# EAGLE design IOBR (EAGLE 9.5.1)
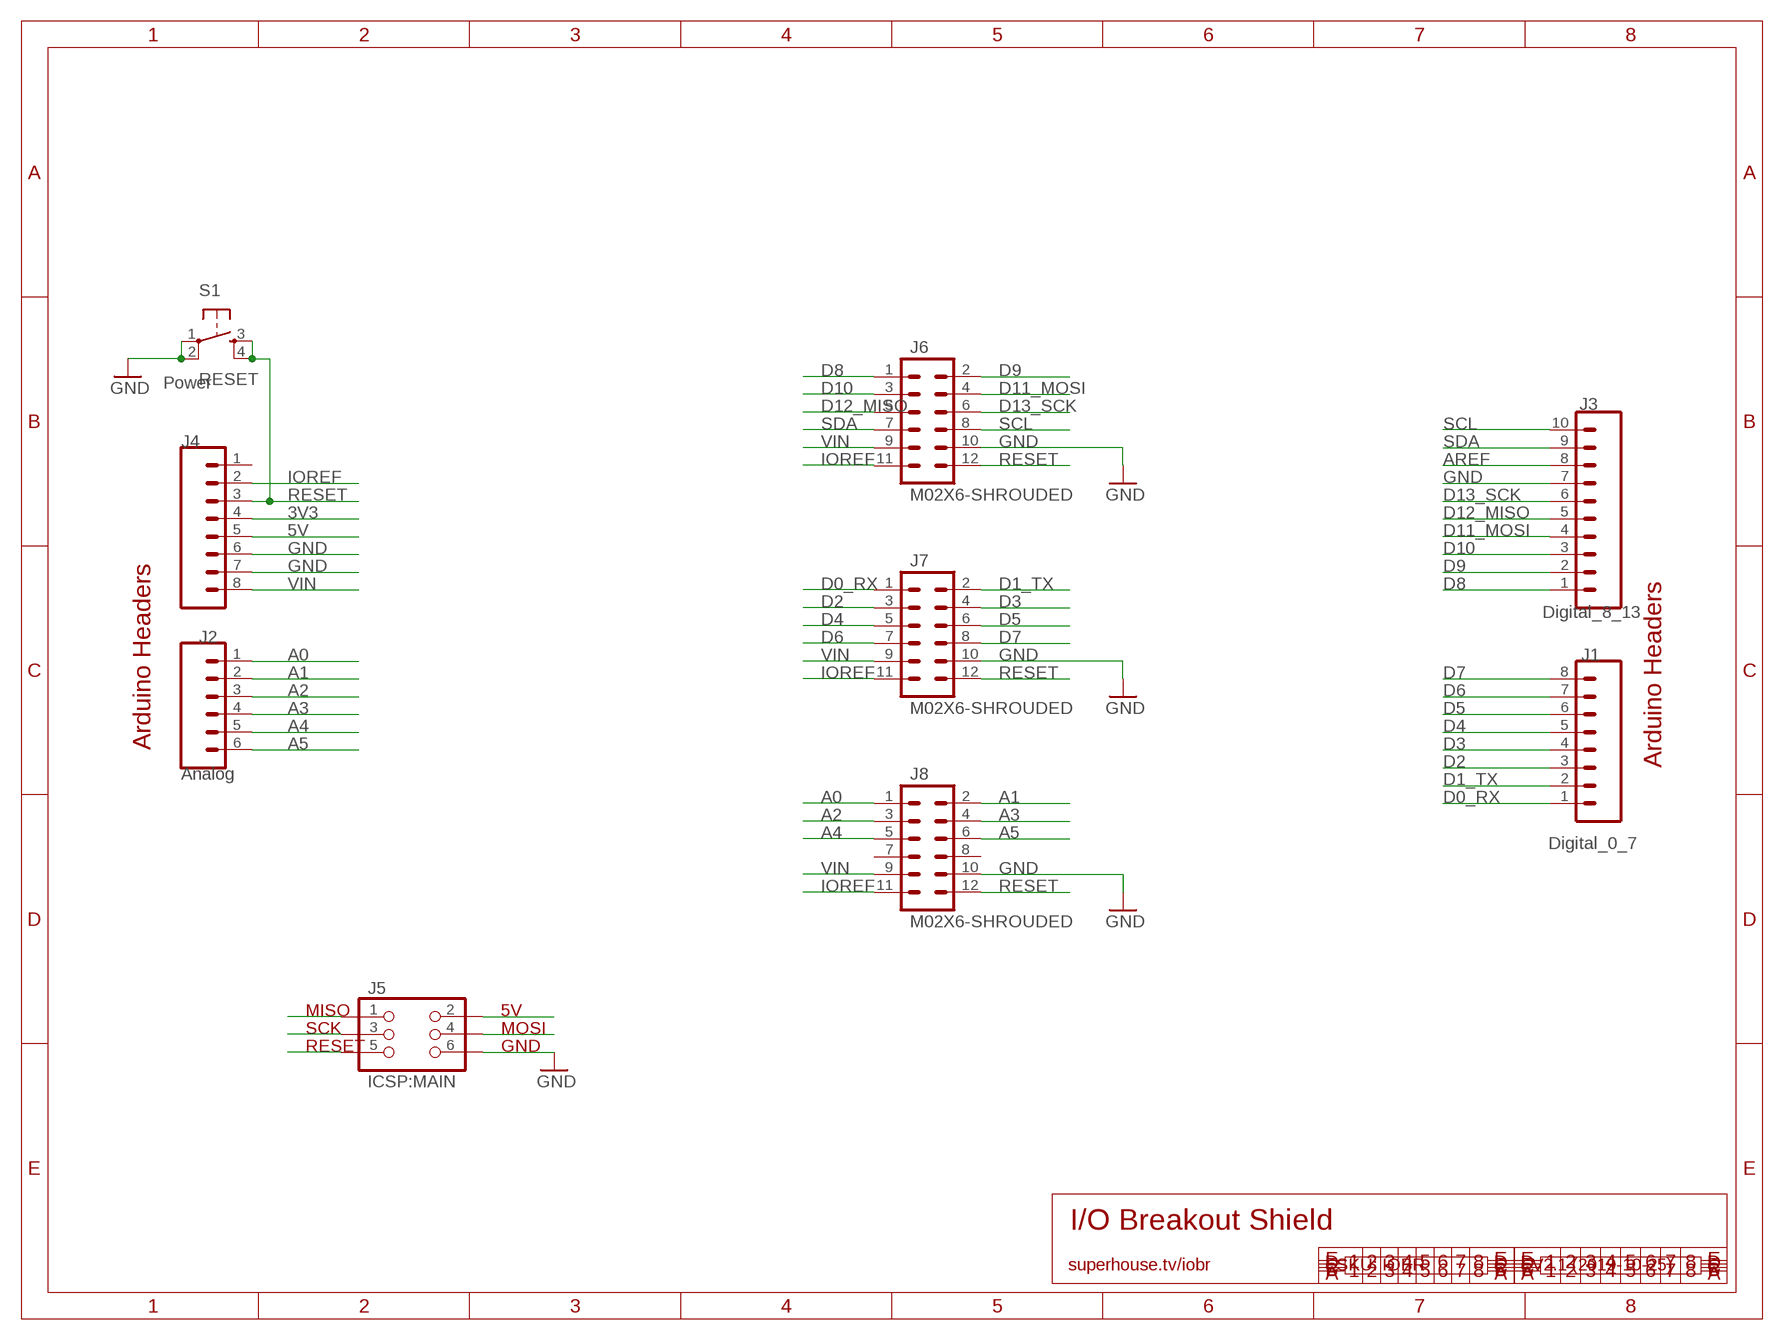
[diagram p0: schematic, sheet 1]

## Parts
J1  Digital_0_7  M08-PIN-BELOW  [1X08-P-BELOW]
J2  Analog  M06-PIN-BELOW  [1X06-P-BELOW]
J3  Digital_8_13  M10-PIN-BELOW  [1X10-P-BELOW]
J4  Power  M08-PIN-BELOW  [1X08-P-BELOW]
J5  ICSP:MAIN  ICSP-ST-BELOW  [2X03-ICSP-ST-BELOW]
J6  M02X6-SHROUDED  [2X06-SHROUDED]
J7  M02X6-SHROUDED  [2X06-SHROUDED]
J8  M02X6-SHROUDED  [2X06-SHROUDED]
S1  RESET  TAC_SWITCH-PTH-6  [TACTILE-PTH-6MM]

## Nets
3V3: J4.4
5V: J4.5
A0: J2.1 J8.1
A1: J2.2 J8.2
A2: J2.3 J8.3
A3: J2.4 J8.4
A4: J2.5 J8.5
A5: J2.6 J8.6
AREF: J3.8
D0_RX: J1.1 J7.1
D1_TX: J1.2 J7.2
D2: J1.3 J7.3
D3: J1.4 J7.4
D4: J1.5 J7.5
D5: J1.6 J7.6
D6: J1.7 J7.7
D7: J1.8 J7.8
D8: J3.1 J6.1
D9: J3.2 J6.2
D10: J3.3 J6.3
D11_MOSI: J3.4 J6.4
D12_MISO: J3.5 J6.5
D13_SCK: J3.6 J6.6
GND: J3.7 J4.6 J4.7 J5.6 J6.10 J7.10 J8.10 S1.1 S1.2
IOREF: J4.2 J6.11 J7.11 J8.11
N$186: J5.1
N$187: J5.3
N$188: J5.5
N$197: J5.2
N$198: J5.4
RESET: J4.3 J6.12 J7.12 J8.12 S1.3 S1.4
SCL: J3.10 J6.8
SDA: J3.9 J6.7
VIN: J4.8 J6.9 J7.9 J8.9
Unconnected: J4.1 J8.7 J8.8

## Notes on the sheet
- Arduino Headers
- Arduino Headers
- MISO | 5V
- SCK | MOSI
- RESET | GND
- I/O Breakout Shield
- superhouse.tv/iobr | SKU: IOBR | V2.1 (2019-10-25)

## Library data of the parts
J1 J4 = SuperHouse-Connectors:M08: 8-way header Standard 1x8 header, and screw terminal variations
J2 = SuperHouse-Connectors:M06: 6-way header Standard 1x6 header, and screw terminal variations
J3 = SuperHouse-Connectors:M10: 10-way header Standard 1x10 header, and screw terminal variations
J5 = SuperHouse-Connectors:ICSP
J6-J8 = SuperHouse-Connectors:M02X6: M12 header in 2x6 format
S1 = SuperHouse-Switches:TAC_SWITCH: Momentary Switch Tactile switch, normally-open.

## Board
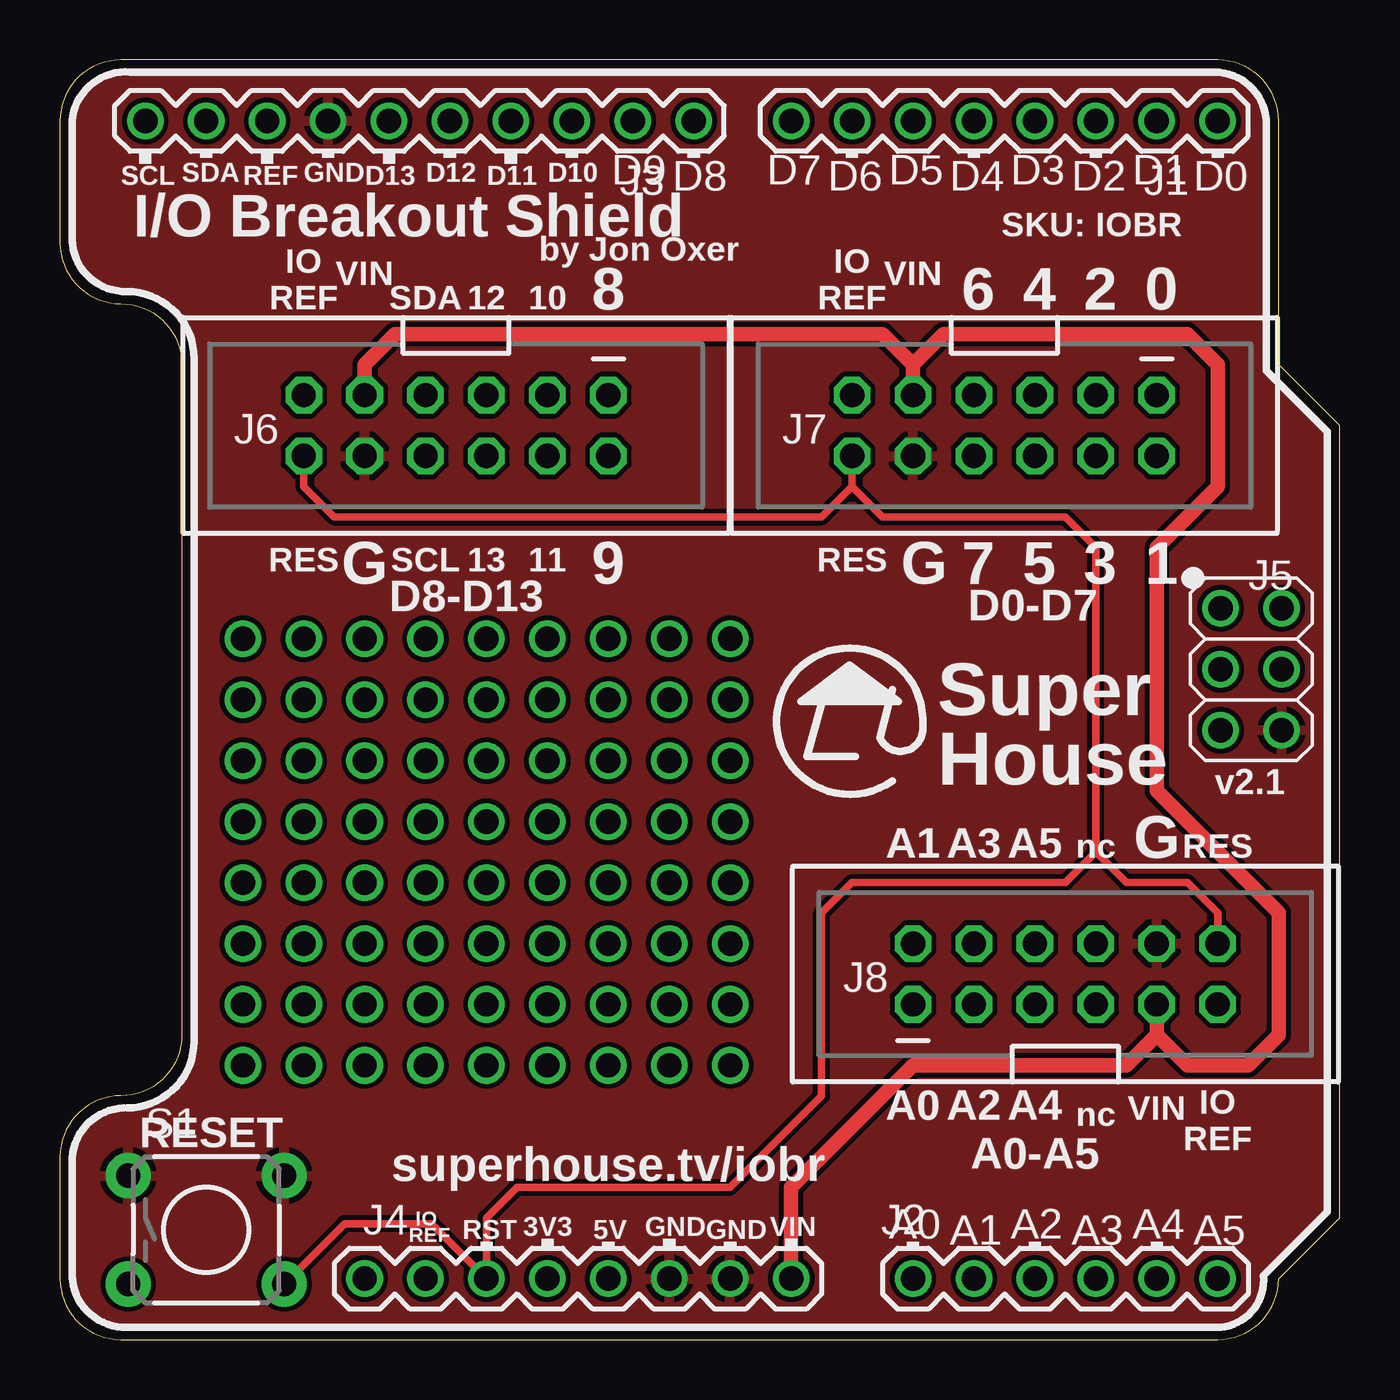
[diagram p1: board, top side]
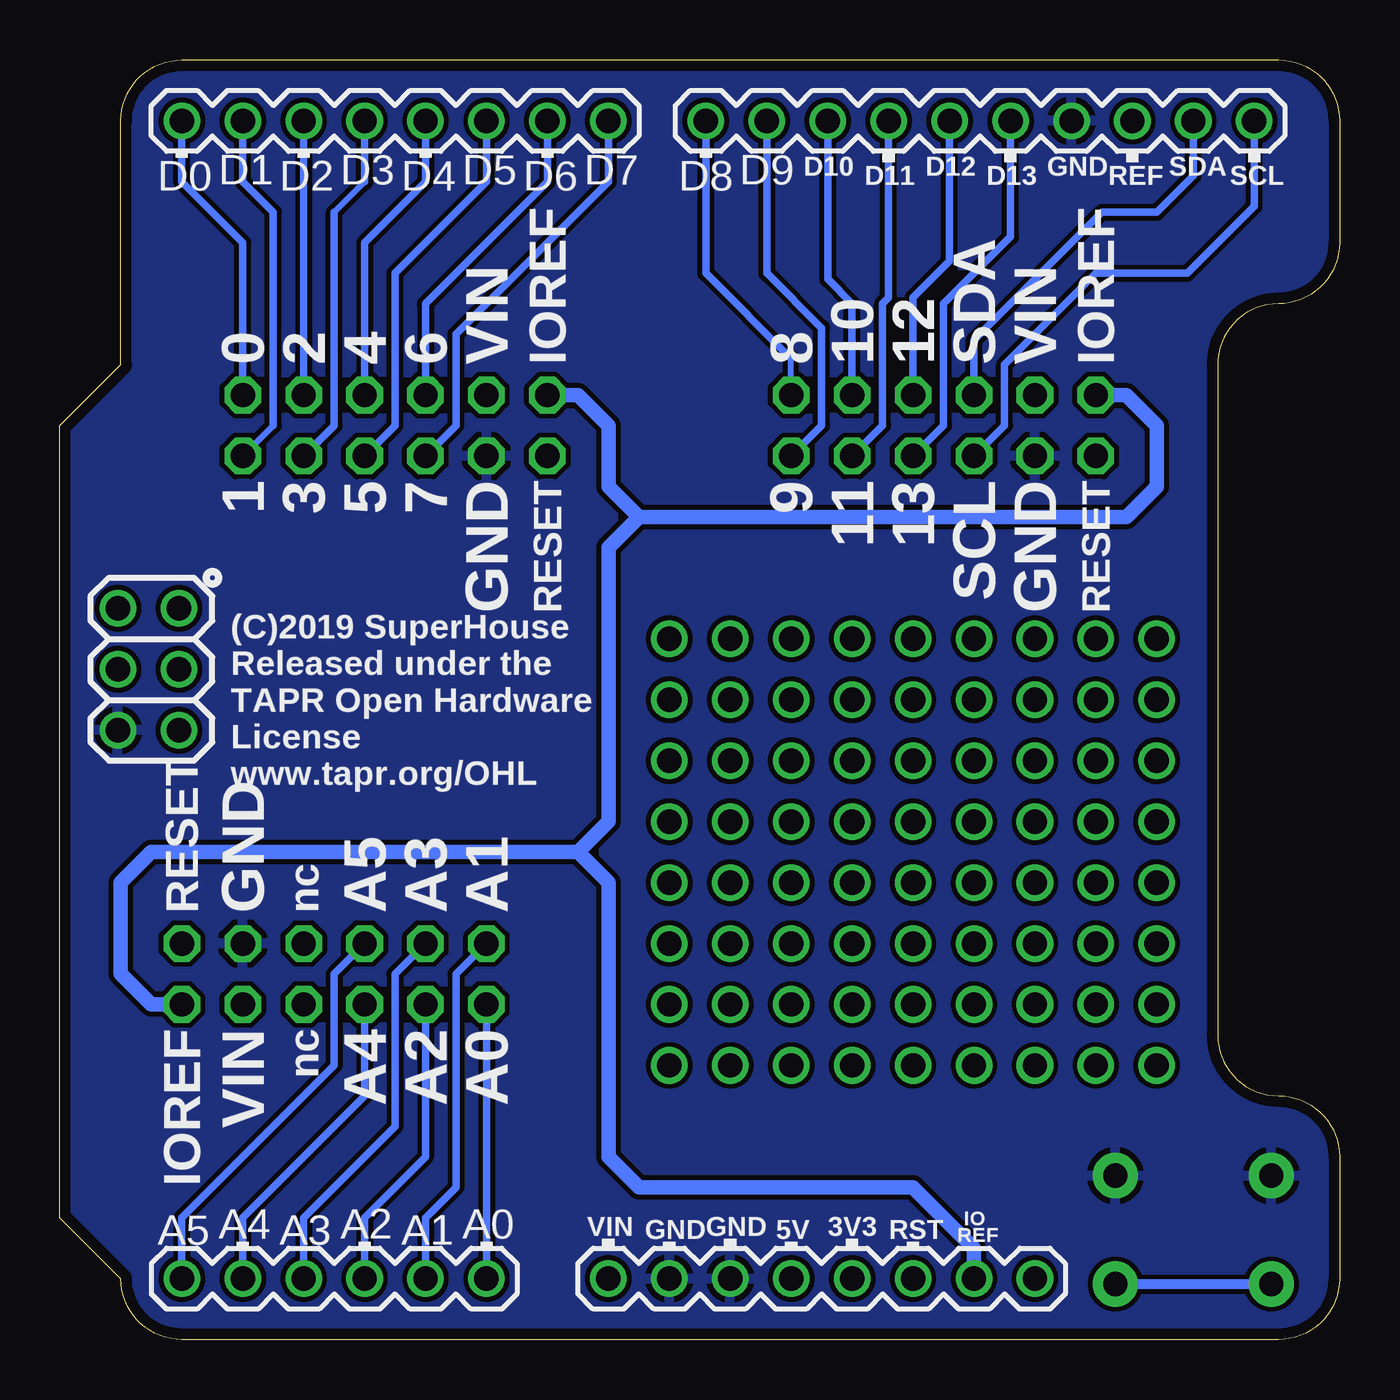
[diagram p2: board, bottom side, seen from below]

Size 53.34 x 53.34 mm. Coordinates in mm from the lower left corner, seen from the top.
Outline: 0,2.54 arc90 2.54,0 48.26,0 arc90 50.8,2.54 53.34,5.08 53.34,38.1 50.8,40.64 50.8,50.8 arc90 48.26,53.34 2.54,53.34 arc90 0,50.8 0,45.72 arc90 2.54,43.18 arc-90 5.08,40.64 5.08,12.7 arc-90 2.54,10.16 arc90 0,7.62 0,2.54
Copper layers (1*16): Top 0.035mm / dielectric 1.5mm / Bottom 0.035mm
Design rules "SuperHouse-Design-Rules": minimum track width 10mil, minimum drill 24mil, track to track 8mil, track to pad 8mil, pad to pad 8mil, via to via 8mil, smd to smd 6mil, copper to edge 18mil, drill to drill 8mil, minimum pad ring 10mil, minimum via ring 8mil, stop-mask expansion 4mil, vias tented up to drill 0.5mm, thermal gap 10mil

### Footprints (pad centres in the part's own frame; a part is rotated, then mirrored left to right if it is on the bottom)
1X08-P-BELOW = drill 1.016: 1 0,0; 2 2.54,0; 3 5.08,0; 4 7.62,0; 5 10.16,0; 6 12.7,0; 7 15.24,0; 8 17.78,0
1X06-P-BELOW = drill 1.016: 1 0,0; 2 2.54,0; 3 5.08,0; 4 7.62,0; 5 10.16,0; 6 12.7,0
1X10-P-BELOW = drill 1.016: 1 0,0; 2 2.54,0; 3 5.08,0; 4 7.62,0; 5 10.16,0; 6 12.7,0; 7 15.24,0; 8 17.78,0; 9 20.32,0; 10 22.86,0
2X03-ICSP-ST-BELOW = drill 1.016: 1 -2.54,-1.27; 2 -2.54,1.27; 3 0,-1.27; 4 0,1.27; 5 2.54,-1.27; 6 2.54,1.27
2X06-SHROUDED = drill 1.016 octagon: 1 0,0; 2 2.54,0; 3 0,-2.54; 4 2.54,-2.54; 5 0,-5.08; 6 2.54,-5.08; 7 0,-7.62; 8 2.54,-7.62; 9 0,-10.16; 10 2.54,-10.16; 11 0,-12.7; 12 2.54,-12.7
TACTILE-PTH-6MM = drill 1.016 pad 1.88: 1 -3.251,2.261; 2 3.251,2.261; 3 -3.251,-2.261; 4 3.251,-2.261

### Placement (x,y rotation side)
J1  48.26,50.8 180 top
J2  35.56,2.54 0 top
J3  26.42,50.8 180 top
J4  12.7,2.54 0 top
J5  49.66,27.94 270 top
J6  22.86,39.37 270 top
J7  45.72,39.37 270 top
J8  35.56,13.97 90 top
S1  6.1,4.57 0 top

### Tracks (layer width: path | path; a pad name or v marks a point on that pad's centre or on a via)
A0
  Bottom 0.305: J8.1 J2.1
A1
  Bottom 0.305: J8.2 36.83,15.24 36.83,6.35 38.1,5.08 J2.2
A2
  Bottom 0.305: J8.3 38.1,7.62 40.64,5.08 J2.3
A3
  Bottom 0.305: J8.4 39.37,15.24 39.37,8.89 43.18,5.08 J2.4
A4
  Bottom 0.305: J8.5 40.64,10.16 45.72,5.08 J2.5
A5
  Bottom 0.305: J8.6 41.91,15.24 41.91,11.43 48.26,5.08 J2.6
D0_RX
  Bottom 0.305: J7.1 45.72,45.72 48.26,48.26 J1.1
D1_TX
  Bottom 0.254: J7.2 44.45,38.1
  Bottom 0.305: 44.45,38.1 44.45,46.99 45.72,48.26 J1.2
D2
  Bottom 0.305: J1.3 J7.3
D3
  Bottom 0.254: 41.91,46.99 40.64,48.26
  Bottom 0.305: J7.4 41.91,38.1 41.91,46.99 | 40.64,48.26 J1.4
D4
  Bottom 0.305: J1.5 38.1,48.26 40.64,45.72 J7.5
D5
  Bottom 0.305: J7.6 39.37,38.1 39.37,44.45 35.56,48.26 J1.6
D6
  Bottom 0.305: J1.7 33.02,48.26 38.1,43.18 J7.7
D7
  Bottom 0.305: J7.8 36.83,38.1 36.83,41.91 30.48,48.26 J1.8
D8
  Bottom 0.254: J6.1 22.86,40.89
  Bottom 0.305: 22.86,40.89 26.42,44.45 J3.1
D9
  Bottom 0.305: J6.2 21.59,38.1 21.59,42.16 23.88,44.45 J3.2
D10
  Bottom 0.305: J6.3 20.32,43.18 21.34,44.2 J3.3
D11_MOSI
  Bottom 0.305: J6.4 19.05,38.1 19.05,43.18 18.8,43.43 J3.4
D12_MISO
  Bottom 0.305: J6.5 17.78,43.43 16.26,44.96 J3.5
D13_SCK
  Bottom 0.305: J6.6 16.51,38.1 16.51,43.18 13.72,45.97 J3.6
GND
  pour Bottom: 0,50.8 arc-74 2.54,53.34 48.26,53.34 arc-74 50.8,50.8 50.8,40.64 53.34,38.1 53.34,5.08 50.8,2.54 arc-74 48.26,0 1.27,0 arc-74 0,2.54 0,7.62 arc-90 2.54,10.16 arc90 5.08,12.7 5.08,40.64 arc90 2.54,43.18 arc-90 0,45.72
  pour Top: 0,50.8 arc-74 2.54,53.34 48.26,53.34 arc-74 50.8,50.8 50.8,40.64 53.34,38.1 53.34,5.08 50.8,2.54 arc-74 48.26,0 1.27,0 arc-74 0,2.54 0,7.62 arc-90 2.54,10.16 arc90 5.08,12.7 5.08,40.64 arc90 2.54,43.18 arc-90 0,45.72
IOREF
  Bottom 0.61: 31.75,20.32 49.53,20.32 50.8,19.05 50.8,15.24 49.53,13.97 J8.11 | 31.75,20.32 30.48,19.05 30.48,7.62 29.21,6.35 17.78,6.35 15.24,3.81 J4.2 | 31.75,20.32 30.48,21.59 30.48,33.02 29.21,34.29 | 29.21,34.29 8.89,34.29 7.62,35.56 7.62,38.1 8.89,39.37 J6.11 | 29.21,34.29 30.48,35.56 30.48,38.1 31.75,39.37 J7.11
N$1  (via drill 1.02)
  other vias: 22.86,16.51
N$2  (via drill 1.02)
  other vias: 22.86,19.05
N$3  (via drill 1.02)
  other vias: 22.86,21.59
N$4  (via drill 1.02)
  other vias: 22.86,24.13
N$5  (via drill 1.02)
  other vias: 22.86,26.67
N$6  (via drill 1.02)
  other vias: 22.86,29.21
N$7  (via drill 1.02)
  other vias: 20.32,29.21
N$8  (via drill 1.02)
  other vias: 17.78,29.21
N$9  (via drill 1.02)
  other vias: 15.24,29.21
N$10  (via drill 1.02)
  other vias: 12.7,29.21
N$11  (via drill 1.02)
  other vias: 12.7,26.67
N$12  (via drill 1.02)
  other vias: 15.24,26.67
N$13  (via drill 1.02)
  other vias: 17.78,26.67
N$14  (via drill 1.02)
  other vias: 20.32,26.67
N$15  (via drill 1.02)
  other vias: 20.32,24.13
N$16  (via drill 1.02)
  other vias: 17.78,24.13
N$17  (via drill 1.02)
  other vias: 15.24,24.13
N$18  (via drill 1.02)
  other vias: 12.7,24.13
N$19  (via drill 1.02)
  other vias: 12.7,21.59
N$20  (via drill 1.02)
  other vias: 15.24,21.59
N$21  (via drill 1.02)
  other vias: 17.78,21.59
N$22  (via drill 1.02)
  other vias: 20.32,21.59
N$23  (via drill 1.02)
  other vias: 20.32,19.05
N$24  (via drill 1.02)
  other vias: 20.32,16.51
N$25  (via drill 1.02)
  other vias: 17.78,16.51
N$26  (via drill 1.02)
  other vias: 15.24,16.51
N$27  (via drill 1.02)
  other vias: 12.7,16.51
N$28  (via drill 1.02)
  other vias: 12.7,19.05
N$29  (via drill 1.02)
  other vias: 15.24,19.05
N$30  (via drill 1.02)
  other vias: 17.78,19.05
N$31  (via drill 1.02)
  other vias: 22.86,13.97
N$32  (via drill 1.02)
  other vias: 20.32,13.97
N$33  (via drill 1.02)
  other vias: 17.78,13.97
N$34  (via drill 1.02)
  other vias: 15.24,13.97
N$35  (via drill 1.02)
  other vias: 12.7,13.97
N$36  (via drill 1.02)
  other vias: 25.4,24.13
N$37  (via drill 1.02)
  other vias: 25.4,26.67
N$38  (via drill 1.02)
  other vias: 25.4,29.21
N$39  (via drill 1.02)
  other vias: 7.62,13.97
N$40  (via drill 1.02)
  other vias: 7.62,16.51
N$41  (via drill 1.02)
  other vias: 25.4,13.97
N$42  (via drill 1.02)
  other vias: 25.4,16.51
N$43  (via drill 1.02)
  other vias: 25.4,19.05
N$44  (via drill 1.02)
  other vias: 25.4,21.59
N$45  (via drill 1.02)
  other vias: 7.62,19.05
N$46  (via drill 1.02)
  other vias: 7.62,21.59
N$47  (via drill 1.02)
  other vias: 7.62,24.13
N$48  (via drill 1.02)
  other vias: 7.62,26.67
N$49  (via drill 1.02)
  other vias: 7.62,29.21
N$50  (via drill 1.02)
  other vias: 22.86,11.43
N$51  (via drill 1.02)
  other vias: 20.32,11.43
N$52  (via drill 1.02)
  other vias: 10.16,13.97
N$53  (via drill 1.02)
  other vias: 10.16,16.51
N$54  (via drill 1.02)
  other vias: 10.16,19.05
N$55  (via drill 1.02)
  other vias: 10.16,21.59
N$56  (via drill 1.02)
  other vias: 10.16,24.13
N$57  (via drill 1.02)
  other vias: 10.16,26.67
N$58  (via drill 1.02)
  other vias: 10.16,29.21
N$59  (via drill 1.02)
  other vias: 17.78,11.43
N$60  (via drill 1.02)
  other vias: 15.24,11.43
N$61  (via drill 1.02)
  other vias: 12.7,11.43
N$62  (via drill 1.02)
  other vias: 25.4,11.43
N$63  (via drill 1.02)
  other vias: 10.16,11.43
N$64  (via drill 1.02)
  other vias: 7.62,11.43
N$65  (via drill 1.02)
  other vias: 27.94,13.97
N$66  (via drill 1.02)
  other vias: 27.94,16.51
N$67  (via drill 1.02)
  other vias: 27.94,19.05
N$68  (via drill 1.02)
  other vias: 27.94,21.59
N$69  (via drill 1.02)
  other vias: 27.94,24.13
N$70  (via drill 1.02)
  other vias: 27.94,26.67
N$71  (via drill 1.02)
  other vias: 27.94,29.21
N$72  (via drill 1.02)
  other vias: 27.94,11.43
RESET
  Top 0.305: S1.4 11.86,4.83 15.49,4.83 J4.3 17.78,5.08 19.05,6.35 27.94,6.35 31.75,10.16 31.75,17.78 33.02,19.05 41.91,19.05 43.18,20.32 | J8.12 48.26,17.78 46.99,19.05 44.45,19.05 43.18,20.32 | 43.18,20.32 43.18,33.02 41.91,34.29 34.29,34.29 33.02,35.56 | 33.02,35.56 J7.12 | J6.12 10.16,35.56 11.43,34.29 31.75,34.29 33.02,35.56
  Bottom 0.406: S1.3 S1.4
SCL
  Bottom 0.305: J6.8 13.97,38.1 13.97,40.64 10.16,44.45 6.35,44.45 3.56,47.24 J3.10
SDA
  Bottom 0.305: J6.7 15.24,41.66 9.91,46.99 7.62,46.99 6.1,48.51 J3.9
VIN
  Top 0.61: 45.72,12.7 44.45,11.43 35.56,11.43 30.48,6.35 J4.8 | J6.9 12.7,40.64 13.97,41.91 34.29,41.91 35.56,40.64 | 35.56,40.64 J7.9 | J8.9 45.72,12.7 | 45.72,12.7 46.99,11.43 49.53,11.43 50.8,12.7 50.8,17.78 45.72,22.86 45.72,33.02 48.26,35.56 48.26,40.64 46.99,41.91 36.83,41.91 35.56,40.64

### Text on the board
tPlace: SCL | SDA | REF | GND | D13 | D12 | D11 | D10 | D9 | D8 | D7 | D6 | D5 | D4 | D3 | D2 | D1 | D0 | I/O Breakout Shield | SKU: IOBR | by Jon Oxer | VIN | VIN | IO / REF | SDA | 12 | 10 | 8 | IO / REF | 6 | 4 | 2 | 0 | RES | SCL | 13 | 11 | RES | G | 9 | G | 7 | 5 | 3 | 1 | D8-D13 | D0-D7 | Super / House | v2.1 | A1 | A3 | A5 | nc | G | RES | A0 | A2 | A4 | nc | VIN | RESET | IO / REF | superhouse.tv/iobr | A0-A5 | IO | REF | RST | 3V3 | 5V | GND | GND | VIN | A0 | A1 | A2 | A3 | A4 | A5
bPlace: SDA | GND | D12 | D10 | SCL | REF | D13 | D11 | D9 | D8 | D7 | D6 | D5 | D4 | D3 | D2 | D1 | D0 | IOREF | VIN | SDA | 12 | 10 | 8 | IOREF | VIN | 6 | 4 | 2 | 0 | RESET | GND | SCL | 13 | 11 | 9 | RESET | GND | 7 | 5 | 3 | 1 | (C)2019 SuperHouse / Released under the / TAPR Open Hardware / License / www.tapr.org/OHL | A1 | A3 | A5 | nc | GND | RESET | A0 | A2 | A4 | nc | VIN | IOREF | IO | REF | RST | 3V3 | 5V | GND | GND | VIN | A0 | A1 | A2 | A3 | A4 | A5